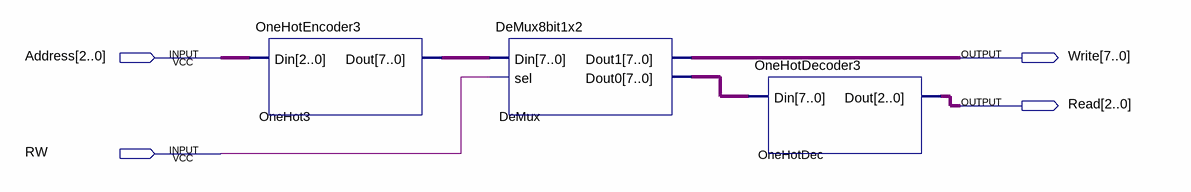
[diagram p0: schematic sheet]
// Quartus schematic Selector3.bdf as structural Verilog: 3 symbols, 4 pins
module Selector3 (
  input  [2:0] Address,
  input  RW,
  output [7:0] Write,
  output [2:0] Read
);

  wire [7:0] DeMux_dout0, OneHot3_dout;

  OneHotEncoder3 OneHot3 (.Din(Address), .Dout(OneHot3_dout));
  DeMux8bit1x2 DeMux (.Din(OneHot3_dout), .sel(RW), .Dout1(Write), .Dout0(DeMux_dout0));
  OneHotDecoder3 OneHotDec (.Din(DeMux_dout0), .Dout(Read));
endmodule
